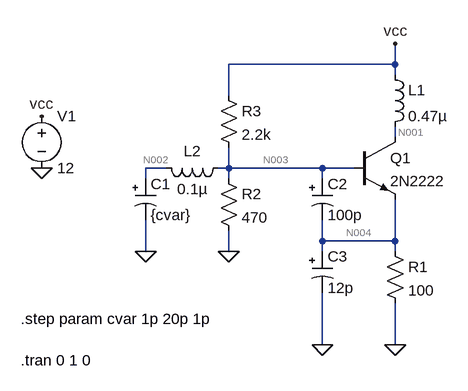
[diagram p0: schematic ClappOscilator.asc]
ClappOscilator.asc, the LTspice schematic file:
Version 4
SHEET 1 880 680
WIRE 416 -16 416 -48
WIRE 416 -16 160 -16
WIRE 416 0 416 -16
WIRE 160 32 160 -16
WIRE 416 96 416 80
WIRE 64 144 32 144
WIRE 160 144 160 112
WIRE 160 144 144 144
WIRE 304 144 160 144
WIRE 352 144 304 144
WIRE 32 160 32 144
WIRE 160 160 160 144
WIRE 304 160 304 144
WIRE 304 256 304 224
WIRE 416 256 416 192
WIRE 416 256 304 256
WIRE 32 272 32 224
WIRE 160 272 160 240
WIRE 304 272 304 256
WIRE 416 272 416 256
WIRE 304 416 304 336
WIRE 416 416 416 352
FLAG 416 416 0
FLAG 304 416 0
FLAG 160 272 0
FLAG 32 272 0
FLAG -128 144 0
FLAG -128 64 vcc
FLAG 416 -48 vcc
SYMBOL polcap 16 160 R0
SYMATTR InstName C1
SYMATTR Value {cvar}
SYMBOL polcap 288 160 R0
SYMATTR InstName C2
SYMATTR Value 100p
SYMBOL polcap 288 272 R0
SYMATTR InstName C3
SYMATTR Value 12p
SYMBOL res 400 256 R0
SYMATTR InstName R1
SYMATTR Value 100
SYMBOL res 144 144 R0
SYMATTR InstName R2
SYMATTR Value 470
SYMBOL res 144 16 R0
SYMATTR InstName R3
SYMATTR Value 2.2k
SYMBOL ind 400 -16 R0
SYMATTR InstName L1
SYMATTR Value 0.47µ
SYMBOL ind 160 128 R90
WINDOW 0 5 56 VBottom 2
WINDOW 3 32 56 VTop 2
SYMATTR InstName L2
SYMATTR Value 0.1µ
SYMBOL npn 352 96 R0
SYMATTR InstName Q1
SYMATTR Value 2N2222
SYMBOL voltage -128 48 R0
WINDOW 123 0 0 Left 0
WINDOW 39 0 0 Left 0
SYMATTR InstName V1
SYMATTR Value 12
TEXT -160 376 Left 2 !.step param cvar 1p 20p 1p
TEXT -160 440 Left 2 !.tran 0 1 0

The netlist it stands for:
* ClappOscilator.asc
C1 N002 0 {cvar}
C2 N003 N004 100p
C3 N004 0 12p
R1 N004 0 100
R2 N003 0 470
R3 vcc N003 2.2k
L1 vcc N001 0.47µ
L2 N003 N002 0.1µ
Q1 N001 N003 N004 0 2N2222
V1 vcc 0 12
.model NPN NPN
.model PNP PNP
.lib standard.bjt
.step param cvar 1p 20p 1p
.tran 0 1 0
.backanno
.end

* Results of the author's LTspice run, read from the files saved beside the schematic
* Operating Point (first step), zero values left out:
*   cvar = 1 p
*   V(n002) = 2.087 V
*   V(n003) = 2.087 V
*   V(n004) = 1.363 V
*   V(vcc) = 12 V
*   V(n001) = 12 V
*   Ic(Q1) = 13.57 mA
*   Ib(Q1) = 64.25 µA
*   Ie(Q1) = -13.63 mA
*   I(L1) = 13.57 mA
*   I(R1) = 13.63 mA
*   I(R2) = 4.441 mA
*   I(R3) = 4.506 mA
*   I(V1) = -18.07 mA